# Altium schematic sheet analog.SchDoc
size A4
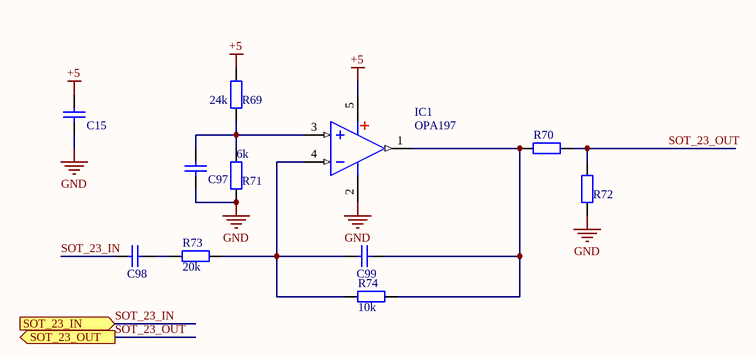
[diagram p0: analog.SchDoc]

## Parts
C15  10nF (103) 10% 50V  [0603_C]  (value not drawn)
C97  100nF (104) 10% 50V  [0603_C]  (value not drawn)
C98  100nF (104) 10% 50V  [0603_C]  (value not drawn)
C99  100nF (104) 10% 50V  [0603_C]  (value not drawn)
IC1  OPA197  [SOT23-5N]
R69  24k  [0603_R]
R70  110Ω (1100) ±1%  [0603_R]  (value not drawn)
R71  6k  [0603_R]
R72  110Ω (1100) ±1%  [0603_R]  (value not drawn)
R73  20k  [0603_R]
R74  10k  [0603_R]

## Ports
SOT_23_IN (in), SOT_23_OUT (out)

## Nets
+5: C15.2 IC1.5(V+) R69.2
GND: C15.1 C97.2 IC1.2(V-) R71.1 R72.1
SOT_23_IN: C98.1 ; port SOT_23_IN
SOT_23_OUT: R70.2 R72.2 ; port SOT_23_OUT
NetC97_1: C97.1 IC1.3(IN+) R69.1 R71.2
NetC98_2: C98.2 R73.1
NetC99_1: C99.1 IC1.1(OUT) R70.1 R74.2
NetC99_2: C99.2 IC1.4(IN-) R73.2 R74.1

## Library data of the parts
C15 = 0603 10nF (103) 10% 50V: 贴片电容; ComponentLink1Description: 供应商链接; ComponentLink1URL: http://www.szlcsc.com/product/details_58143.html; Package: 0603; Supplier: LC; SuppliersPartNumber: C57112
C97-C99 = 0603 100nF (104) 10% 50V: 贴片电容; ComponentLink1Description: 供应商链接; ComponentLink1URL: http://www.szlcsc.com/product/details_15331.html; Package: 0603; Supplier: LC; SuppliersPartNumber: C14663
IC1 = SGM8521-5Pin: SOT23-5_轨至轨运放; BOM名称: 轨至轨运放; 版权归属: 源创客; 学习资源: www.ooocke.com
R69-R74 = 0603 110Ω (1100) 1%: 贴片电阻; ComponentLink1Description: 供应商链接; ComponentLink1URL: http://www.szlcsc.com/product/details_23508.html; Package: 0603; Supplier: LC; SuppliersPartNumber: C22781